# EAGLE design SparkFun RTK Facet - Cellular (EAGLE 9.6.2)
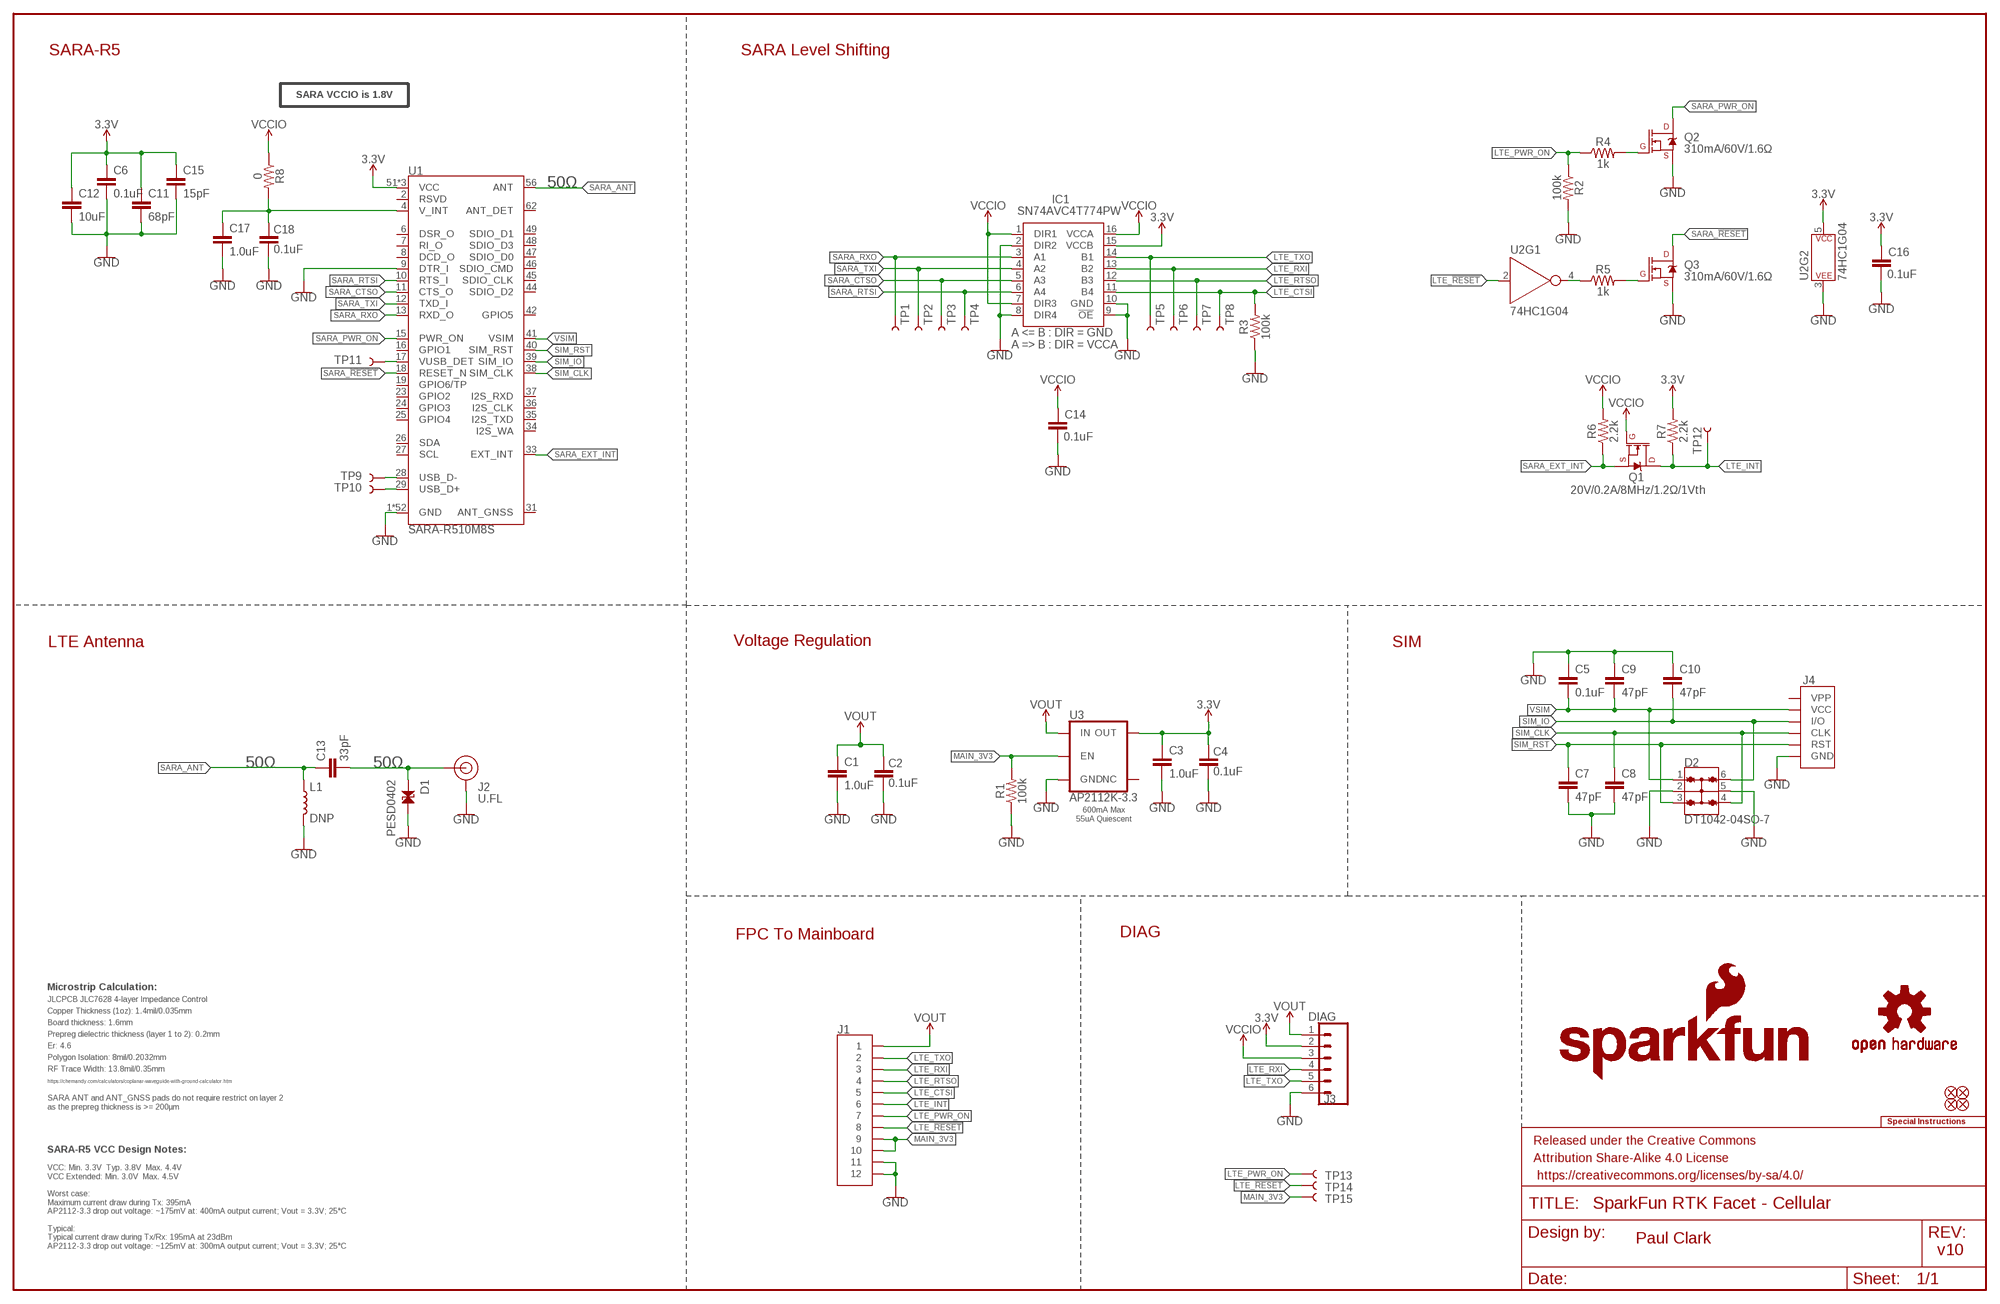
[diagram p0: schematic, sheet 1]

## Parts
C1  1.0uF  1.0UF-0603-16V-10%-X7R  [0603]
C2  0.1uF  0.1UF-0603-25V-5%  [0603]
C3  1.0uF  1.0UF-0603-16V-10%-X7R  [0603]
C4  0.1uF  0.1UF-0603-25V-5%  [0603]
C5  0.1uF  0.1UF-0603-25V-5%  [0603]
C6  0.1uF  0.1UF-0603-25V-5%  [0603]
C7  47pF  47PF-0603-50V-5%  [0603]
C8  47pF  47PF-0603-50V-5%  [0603]
C9  47pF  47PF-0603-50V-5%  [0603]
C10  47pF  47PF-0603-50V-5%  [0603]
C11  68pF  68PF-0603-50V-5%  [0603]
C12  10uF  10UF-0603-6.3V-20%  [0603]
C13  33pF  33PF-0402-25V-5%-X7R  [0402]
C14  0.1uF  0.1UF-0603-25V-(+80/-20%)  [0603]
C15  15pF  15PF-0603-50V-5%  [0603]
C16  0.1uF  0.1UF-0603-25V-(+80/-20%)  [0603]
C17  1.0uF  1.0UF-0603-16V-10%-X7R  [0603]
C18  0.1uF  0.1UF-0603-25V-5%  [0603]
D1  PESD0402  [0402]
D2  DT1042-04SO-7  TVS_DIODE_ARRAY_4DT1042-04SO-7  [SOT23-6L]
FID1  FIDUCIAL1X2  [FIDUCIAL-1X2]
FID2  FIDUCIAL1X2  [FIDUCIAL-1X2]
FID3  FIDUCIAL1X2  [FIDUCIAL-1X2]
FID4  FIDUCIAL1X2  [FIDUCIAL-1X2]
FRAME3  FRAME-LEDGER  [CREATIVE_COMMONS]
IC1  SN74AVC4T774PW  [SOP65P640X120-16N]
J1  FPC_12_0.5MM_BACKFLIP  [FPC_12_DOUBLESIDED_BACKFLIP]
J2  U.FL  U.FL2PIN  [U.FL]
J3  DIAG  CONN_06NO_SILK_FEMALE_PTH  [1X06_NO_SILK]
J4  SIMHOLDER-PUSHPUSH-REDUCED-PADS  [NANO_SIM_PP_REDUCED_PADS]
L1  DNP  INDUCTOR_DNP-0402  [0402_COILCRAFT]
LOGO1  SPECIAL_INSTRUCTIONS-ORDERING  [ORDERING_INSTRUCTIONS]
LOGO2  SFE_LOGO_NAME_FLAME.1_INCH  [SFE_LOGO_NAME_FLAME_.1]
LOGO3  OSHW-LOGOMINI  [OSHW-LOGO-MINI]
LOGO4  OSHW-LOGOMINI  [OSHW-LOGO-MINI]
LOGO5  SFE_LOGO_NAME_FLAME.1_INCH  [SFE_LOGO_NAME_FLAME_.1]
Q1  20V/0.2A/8MHz/1.2Ω/1Vth  MOSFET-NCH-RE1C002UNTCL  [SOT-416FL]
Q2  310mA/60V/1.6Ω  MOSFET-NCH-2N7002PW  [SOT323]
Q3  310mA/60V/1.6Ω  MOSFET-NCH-2N7002PW  [SOT323]
R1  100k  100KOHM-0603-1/10W-1%  [0603]
R2  100k  100KOHM-0603-1/10W-1%  [0603]
R3  100k  100KOHM-0603-1/10W-1%  [0603]
R4  1k  1KOHM-0603-1/10W-1%  [0603]
R5  1k  1KOHM-0603-1/10W-1%  [0603]
R6  2.2k  2.2KOHM-0603-1/10W-1%  [0603]
R7  2.2k  2.2KOHM-0603-1/10W-1%  [0603]
R8  0  0OHM-0603-1/10W  [0603]
TP1  TEST-POINT3  [PAD.03X.03]
TP2  TEST-POINT3  [PAD.03X.03]
TP3  TEST-POINT3  [PAD.03X.03]
TP4  TEST-POINT3  [PAD.03X.03]
TP5  TEST-POINT3  [PAD.03X.03]
TP6  TEST-POINT3  [PAD.03X.03]
TP7  TEST-POINT3  [PAD.03X.03]
TP8  TEST-POINT3  [PAD.03X.03]
TP9  TEST-POINT3  [PAD.03X.03]
TP10  TEST-POINT3  [PAD.03X.03]
TP11  TEST-POINT3  [PAD.03X.03]
TP12  TEST-POINT3  [PAD.03X.03]
TP13  TEST-POINT3  [PAD.03X.03]
TP14  TEST-POINT3  [PAD.03X.03]
TP15  TEST-POINT3  [PAD.03X.03]
U1  SARA-R510M8S  [SARA-LGA]
U2  74HC1G04  [SOT353]
U3  AP2112K-3.3  V_REG_AP2112K-3.3V  [SOT23-5]

## Nets
3.3V [power]: C3.1 C4.2 C6.1 C11.1 C12.1 C15.1 C16.1 IC1.15(VCCB) J3.2 R7.2 U1.51(VCC) U1.52(VCC) U1.53(VCC) U2.5(P$V+) U3.5(OUT)
GND: C1.2 C2.1 C3.2 C4.1 C5.1 C6.2 C7.2 C8.2 C9.1 C10.1 C11.2 C12.2 C14.2 C15.2 C16.2 C17.2 C18.1 D1.2 D2.2 D2.5 IC1.2(DIR2) IC1.8(DIR4) IC1.9(!OE) IC1.10(GND) J1.11 J1.12 J2.1(GND) J2.2(GND) J3.6 J4.C5(GND) L1.P$2 Q2.2(S) Q3.2(S) R1.1 R2.2 R3.1 U1.1(GND) U1.3(GND) U1.5(GND) U1.9(DTR_I) U1.14(GND) U1.20(GND) U1.21(GND) U1.22(GND) U1.30(GND) U1.32(GND) U1.43(GND) U1.50(GND) U1.54(GND) U1.55(GND) U1.57(GND) U1.58(GND) U1.59(GND) U1.60(GND) U1.61(GND) U1.63(GND) U1.64(GND) U1.65(GND) U1.66(GND) U1.67(GND) U1.68(GND) U1.69(GND) U1.70(GND) U1.71(GND) U1.72(GND) U1.73(GND) U1.74(GND) U1.75(GND) U1.76(GND) U1.77(GND) U1.78(GND) U1.79(GND) U1.80(GND) U1.81(GND) U1.82(GND) U1.83(GND) U1.84(GND) U1.85(GND) U1.86(GND) U1.87(GND) U1.88(GND) U1.89(GND) U1.90(GND) U1.91(GND) U1.92(GND) U1.93(GND) U1.94(GND) U1.95(GND) U1.96(GND) U2.3(P$V-) U3.2(GND)
LTE_!RESET!: J1.8 TP14.1 U2.2(A)
LTE_CTSI: IC1.11(B4) J1.5 R3.2 TP8.1
LTE_INT: J1.6 Q1.3(D) R7.1 TP12.1
LTE_PWR_ON: J1.7 R2.1 R4.1 TP13.1
LTE_RTSO: IC1.12(B3) J1.4 TP7.1
LTE_RXI: IC1.13(B2) J1.3 J3.4 TP6.1
LTE_TXO: IC1.14(B1) J1.2 J3.5 TP5.1
MAIN_3V3: J1.9 J1.10 R1.2 TP15.1 U3.3(EN)
N$1: TP9.1 U1.28(USB_D-)
N$2: TP10.1 U1.29(USB_D+)
N$3: TP11.1 U1.17(VUSB_DET)
N$15: C13.2 D1.1 J2.FEED(SIGNAL)
N$26: Q2.1(G) R4.2
N$27: Q3.1(G) R5.2
N$28: R5.1 U2.4(Y)
N$31: C17.1 C18.2 R8.2 U1.4(V_INT)
SARA_!RESET!: Q3.3(D) U1.18(RESET_N)
SARA_ANT: C13.1 L1.P$1 U1.56(ANT)
SARA_CTSO: IC1.5(A3) TP3.1 U1.11(CTS_O)
SARA_EXT_INT: Q1.2(S) R6.1 U1.33(EXT_INT)
SARA_PWR_ON: Q2.3(D) U1.15(PWR_ON)
SARA_RTSI: IC1.6(A4) TP4.1 U1.10(RTS_I)
SARA_RXO: IC1.3(A1) TP1.1 U1.13(RXD_O)
SARA_TXI: IC1.4(A2) TP2.1 U1.12(TXD_I)
SIM_CLK: C8.1 D2.4 J4.C3(CLK) U1.38(SIM_CLK)
SIM_IO: C10.2 D2.6 J4.C7(I/O) U1.39(SIM_IO)
SIM_RST: C7.1 D2.3 J4.C2(RST) U1.40(SIM_RST)
VCCIO: C14.1 IC1.1(DIR1) IC1.7(DIR3) IC1.16(VCCA) J3.3 Q1.1(G) R6.2 R8.1
VOUT: C1.1 C2.2 J1.1 J3.1 U3.1(IN)
VSIM: C5.2 C9.2 D2.1 J4.C1(VCC) U1.41(VSIM)
Unconnected: J4.C6(VPP) U1.2(RSVD) U1.6(DSR_O) U1.7(RI_O) U1.8(DCD_O) U1.16(GPIO1) U1.19(GPIO6/TP) U1.23(GPIO2) U1.24(GPIO3) U1.25(GPIO4) U1.26(SDA) U1.27(SCL) U1.31(ANT_GNSS) U1.34(I2S_WA) U1.35(I2S_TXD) U1.36(I2S_CLK) U1.37(I2S_RXD) U1.42(GPIO5) U1.44(SDIO_D2) U1.45(SDIO_CLK) U1.46(SDIO_CMD) U1.47(SDIO_D0) U1.48(SDIO_D3) U1.49(SDIO_D1) U1.62(ANT_DET) U3.4(NC)

## Notes on the sheet
- SARA-R5 | SARA Level Shifting
- SARA VCCIO is 1.8V
- 50Ω
- LTE Antenna | Voltage Regulation | SIM
- 50Ω | 50Ω
- 600mA Max
  55uA Quiescent
- FPC To Mainboard | DIAG
- Microstrip Calculation:
- JLCPCB JLC7628 4-layer Impedance Control
- Copper Thickness (1oz): 1.4mil/0.035mm
- Board thickness: 1.6mm
- Prepreg dielectric thickness (layer 1 to 2): 0.2mm
- Er: 4.6
- Polygon Isolation: 8mil/0.2032mm
- RF Trace Width: 13.8mil/0.35mm
- https://chemandy.com/calculators/coplanar-waveguide-with-ground-calculator.htm
- SARA ANT and ANT_GNSS pads do not require restrict on layer 2
  as the prepreg thickness is >= 200µm
- SARA-R5 VCC Design Notes:
- VCC: Min. 3.3V  Typ. 3.8V  Max. 4.4V
  VCC Extended: Min. 3.0V  Max. 4.5V
  
  Worst case:
  Maximum current draw during Tx: 395mA
  AP2112-3.3 drop out voltage: ~175mV at: 400mA output current; Vout = 3.3V; 25°C
  
  Typical:
  Typical current draw during Tx/Rx: 195mA at 23dBm
  AP2112-3.3 drop out voltage: ~125mV at: 300mA output current; Vout = 3.3V; 25°C
- Paul Clark
- v10

## Library data of the parts
C1 C3 C17 = SparkFun-Capacitors:1.0UF: 1µF ceramic capacitors A capacitor is a passive two-terminal electrical component used to store electrical energy temporarily in an electric field.; PROD_ID: CAP-13930
C2 C4-C6 C18 = SparkFun-Capacitors:0.1UF: 0.1µF ceramic capacitors A capacitor is a passive two-terminal electrical component used to store electrical energy temporarily in an electric field.; PROD_ID: CAP-08604
C7-C10 = SparkFun-Capacitors:47PF: 47pF ceramic capacitors A capacitor is a passive two-terminal electrical component used to store electrical energy temporarily in an electric field.; PROD_ID: CAP-08913
C11 = SparkFun-Capacitors:68PF: 68pF ceramic capacitors A capacitor is a passive two-terminal electrical component used to store electrical energy temporarily in an electric field.; PROD_ID: CAP-14092
C12 = SparkFun-Capacitors:10UF: 10.0µF ceramic capacitors A capacitor is a passive two-terminal electrical component used to store electrical energy temporarily in an electric field.; PROD_ID: CAP-11015
C13 = New_Parts:33PF: 33pF ceramic capacitors A capacitor is a passive two-terminal electrical component used to store electrical energy temporarily in an electric field.; DIGIKEY_PART: 490-5936-1-ND; MANUFACTURER: Murata; MANU_PART: GRM1555C1H330JA; PROD_ID: CAP-15358
C14 C16 = SparkFun-Capacitors:0.1UF: 0.1µF ceramic capacitors A capacitor is a passive two-terminal electrical component used to store electrical energy temporarily in an electric field.; PROD_ID: CAP-00810
C15 = SparkFun-Capacitors:15PF: 15pF ceramic capacitors A capacitor is a passive two-terminal electrical component used to store electrical energy temporarily in an electric field.; PROD_ID: CAP-07881
D1 = New_Parts:PESD0402: ESD protection diode PESD is used to protect a signal line from ESD.; DIGIKEY_PART: PESD0402-140CT-ND; MOUSE_PART: 650-PESD0402-140; PROD_ID: DIO-15359
D2 = ublox:TVS_DIODE_ARRAY_4; PROD_ID: DIO-14095
FID1-FID4 = SparkFun-Aesthetics:FIDUCIAL: Fiducial Alignment Points Point-of-reference for pick-and-place machines and other optical instruments.
FRAME3 = SparkFun-Aesthetics:FRAME-LEDGER: Schematic Frame - Ledger Standard 11x14 US Ledger frame
IC1 = New_Parts:SN74AVC4T774PW: Texas Instruments,SN74AVC4T774PW,IC, Texas Instruments SN74AVC4T774PW, Dual, Bus Transceiver, 4-Bit Non-Inverting 3-State, 1.2 3.6 V, 16-Pin TSSOP Source: Datasheet <http://www.ti.com/lit/ds/symlink/sn74avc4t774.pdf>; ARROW_PART_NUMBER: SN74AVC4T774PW; ARROW_PRICE-STOCK: https://www.arrow.com/en/products/sn74avc4t774pw/texas-instruments; DESCRIPTION: Texas Instruments,SN74AVC4T774PW,IC, Texas Instruments SN74AVC4T774PW, Dual, Bus Transceiver, 4-Bit Non-Inverting 3-State, 1.2 3.6 V, 16-Pin TSSOP; MANUFACTURER_NAME: Texas Instruments; MANUFACTURER_PART_NUMBER: SN74AVC4T774PW; MOUSER_PART_NUMBER: 595-SN74AVC4T774PW; MOUSER_PRICE-STOCK: https://www.mouser.co.uk/ProductDetail/Texas-Instruments/SN74AVC4T774PW?qs=WxL8HmPi5r44hV1AE7gRvg%3D%3D; PROD_ID: IC-15360
J1 = RTK Facet:FPC_12_0.5MM; PROD_ID: CONN-15766
J2 = SparkFun-Connectors:U.FL2PIN: SMD Antenna Connector - U.FL 2mm height, 3.0mm x 3.0mm receptacle size. SparkFun Products: SparkFun WiFi Shield - ESP8266 <https://www.sparkfun.com/products/13287> SparkFun ESP8266 Thing <https://www.sparkfun.com/products/13231> SparkFun MiniGen - Pro Mini Signal Generator Shield <https://www.sparkfun.com/products/11420>; PROD_ID: CONN-09193; SF_ID: WRL-09144
J3 = SparkFun-Connectors:CONN_06: Multi connection point. Often used as Generic Header-pin footprint for 0.1 inch spaced/style header connections On any of the 0.1 inch spaced packages, you can populate with these: Break Away Headers - Straight <https://www.sparkfun.com/products/116> (PRT-00116) Break Away Male Headers - Right Angle <https://www.sparkfun.com/products/553> (PRT-00553) Female Headers <https://www.sparkfun.com/products/115> (PRT-00115) Break Away Headers - Machine Pin <https://www.sparkfun.com/products/117> (PRT-00117) Break Away Female Headers - Swiss Machine Pin <https://www.sparkfun.com/products/743> (PRT-00743) Arduino Stackable Header - 6 Pin <https://www.sparkfun.com/products/9280> (PRT-09280) For SCREWTERMINALS and SPRING TERMINALS visit here: Screw Terimnals on SparkFun.com <https://www.sparkfun.com/search/results?term=Screw+Terminals> (5mm/3.5mm/2.54mm spacing) This device is also useful as a general connection point to wire up your design to another part of your project. Our various solder wires solder well into these plated through hole pads. Hook-Up Wire - Assortment (Stranded, 22 AWG) <https://www.sparkfun.com/products/11375> (PRT-11375) Hook-Up Wire - Assortment (Solid Core, 22 AWG) <https://www.sparkfun.com/products/11367> (PRT-11367) View the entire wire category on our website here <https://www.sparkfun.com/categories/141>; PROD_ID: CONN-08437
J4 = SparkFun-Connectors:SIMHOLDER: SIM Cellular Card Socket SMT 6 pin standard connection. SparkFun Products: SIM Socket <https://www.sparkfun.com/products/548> SparkFun Cellular Shield - MG2639 <https://www.sparkfun.com/products/13120> SparkFun SIM Card Socket Breakout <https://www.sparkfun.com/products/573>; PROD_ID: CONN-16272
L1 = New_Parts:INDUCTOR_DNP
LOGO1 = SparkFun-Aesthetics:SPECIAL_INSTRUCTIONS: Special Ordering/Production Instructions Alert Symbol for special PCB ordering instructions or unique production process warnings. Ordering Instructions Production Instructions Types of information that should be added to box: Copper weight Soldermask color Silk color PCB thickness Number of layers PCB Standard: 1.6mm FR4 1 oz copper immersion silver plating red soldermask white silkscreen Types of information that should be added to box: Special wash requirements Depaneling instructions Humidification Glue curing Default text settings: 0.07 inch 9% ratio 50% line distance
LOGO2 LOGO5 = SparkFun-Aesthetics:SFE_LOGO_NAME_FLAME: SparkFun Font Logo w/ Flame This is the SparkFun full logo. The logo on the schematic will always be the same size; the package variant is the height of the flame part of the logo. Default layer for the logo on the board is tSilk.
LOGO3 LOGO4 = SparkFun-Aesthetics:OSHW-LOGO: Open-Source Hardware (OSHW) Logo This logo indicates the piece of hardware it is found on incorporates a OSHW license and/or adheres to the definition of open source hardware found here: http://freedomdefined.org/OSHW
Q1 = SparkFun-DiscreteSemi:MOSFET-NCH: N-channel MOSFETs Voltage controlled devices that allow control of high current outputs. SparkFun Products: SparkFun OpenScale <https://www.sparkfun.com/products/13261> SparkFun Digital Sandbox <https://www.sparkfun.com/products/12651> SparkFun Monster Moto Shield <https://www.sparkfun.com/products/10182> SparkFun MOSFET Power Controller <https://www.sparkfun.com/products/11214>; PROD_ID: TRANS-14399
Q2 Q3 = SparkFun-DiscreteSemi:MOSFET-NCH: N-channel MOSFETs Voltage controlled devices that allow control of high current outputs. SparkFun Products: SparkFun OpenScale <https://www.sparkfun.com/products/13261> SparkFun Digital Sandbox <https://www.sparkfun.com/products/12651> SparkFun Monster Moto Shield <https://www.sparkfun.com/products/10182> SparkFun MOSFET Power Controller <https://www.sparkfun.com/products/11214>; PROD_ID: TRANS-11151
R1-R3 = SparkFun-Resistors:100KOHM: 100kΩ resistor A resistor is a passive two-terminal electrical component that implements electrical resistance as a circuit element. Resistors act to reduce current flow, and, at the same time, act to lower voltage levels within circuits. - Wikipedia; PROD_ID: RES-07828
R4 R5 = SparkFun-Resistors:1KOHM: 1kΩ resistor A resistor is a passive two-terminal electrical component that implements electrical resistance as a circuit element. Resistors act to reduce current flow, and, at the same time, act to lower voltage levels within circuits. - Wikipedia; PROD_ID: RES-07856
R6 R7 = SparkFun-Resistors:2.2KOHM: 2.2kΩ resistor A resistor is a passive two-terminal electrical component that implements electrical resistance as a circuit element. Resistors act to reduce current flow, and, at the same time, act to lower voltage levels within circuits. - Wikipedia; PROD_ID: RES-08272
R8 = SparkFun-Resistors:0OHM: 0Ω resistor A resistor is a passive two-terminal electrical component that implements electrical resistance as a circuit element. Resistors act to reduce current flow, and, at the same time, act to lower voltage levels within circuits. - Wikipedia; PROD_ID: RES-08609
TP1-TP15 = SparkFun-Connectors:TEST-POINT: SparkFun Test Points Bare copper test points for troubleshooting or In-Circuit-Testing. These are used by our Production team for verifying production board runs using pogo-pins on test beds. SparkFun Products: SparkFun LSM9DS1 Breakout <https://www.sparkfun.com/products/13284> SparkFun PSOC <https://www.sparkfun.com/products/13714> SparkFun Load Cell Amplifier <https://www.sparkfun.com/products/13879>
U1 = SARA_R5:SARA-R510M8S; PROD_ID: IC-15573
U2 = SparkFun-IC-Logic:74*1G04: Single Inverter IC NOT GATE INVERTER SNGL 1IN SOT353 Supply: 1.65V to 5.5V Datasheet <http://diodes.com/datasheets/74LVC1G04.pdf> SparkFun Products SparkFun Stepoko <https://www.sparkfun.com/products/13899> (ROB-13899) SparkFun CryptoShield <https://www.sparkfun.com/products/13183> (DEV-13183) SparkFun LogicBlocks Kit <https://www.sparkfun.com/products/11006> (KIT-11006) SparkFun ArduMoto <https://www.sparkfun.com/products/9815> (DEV-09815); PROD_ID: COMP-08268
U3 = SparkFun-IC-Power:V_REG_AP2112: AP2112 - 600mA CMOS LDO Regulator w/ Enable The AP2112 is CMOS process low dropout linear regulator with enable function, the regulator delivers a guaranteed 600mA (min.) continuous load current. Features Output Voltage Accuracy: ±1.5% Output Current: 600mA (Min.) Foldback Short Current Protection: 50mA Enable Function to Turn ON/OFF VOUT Low Dropout Voltage (3.3V): 250mV (Typ.) @IOUT=600mA Excellent Load Regulation: 0.2%/A (Typ.) Excellent Line Regulation: 0.02%/V (Typ.) Low Quiescent Current: 55μA (Typ.) Low Standby Current: 0.01μA (Typ.) Low Output Noise: 50μVRMS PSRR: 100Hz -65dB, 1kHz -65dB OTSD Protection Stable with 1.0μF Flexible Cap: Ceramic, Tantalum and Aluminum Electrolytic Operation Temperature Range: -40°C to 85°C ESD: MM 400V, HBM 4000V; PROD_ID: VREG-12457; VALUE: 3.3V

## Net classes
0 default: width 0 mm, drill 0 mm
1 power: width 0.178 mm

## Board
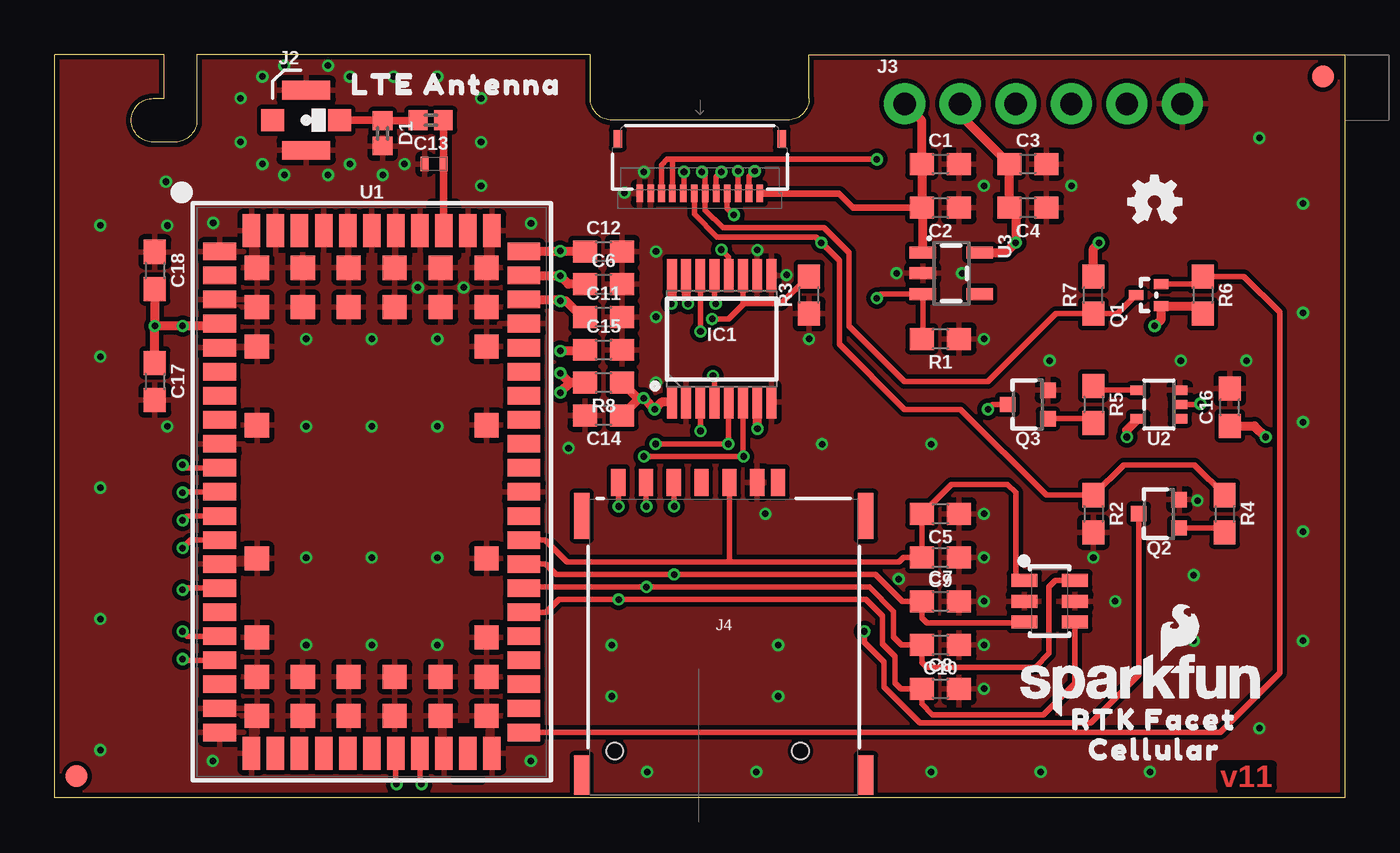
[diagram p1: board, top side]
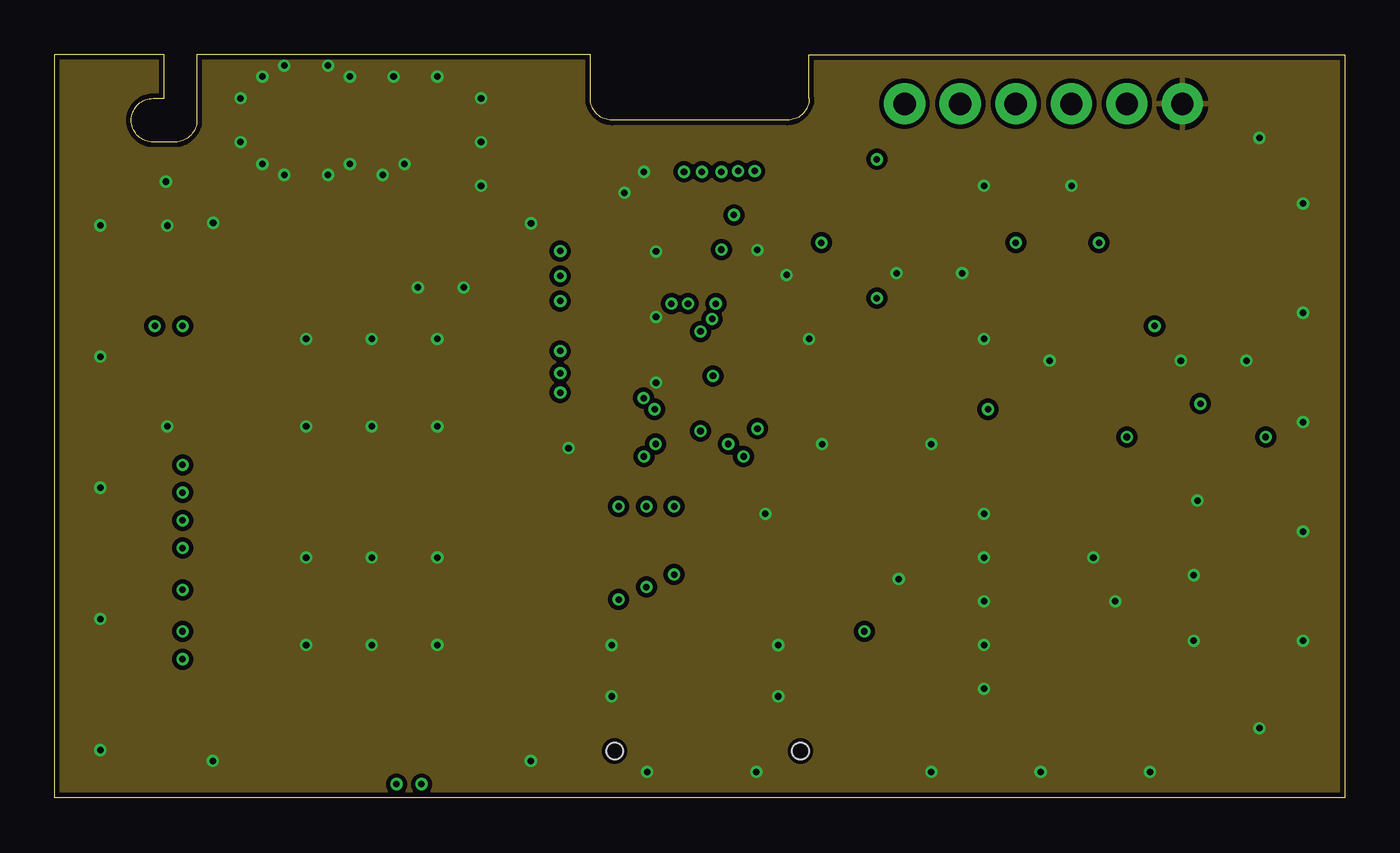
[diagram p2: board, inner layer Route2]
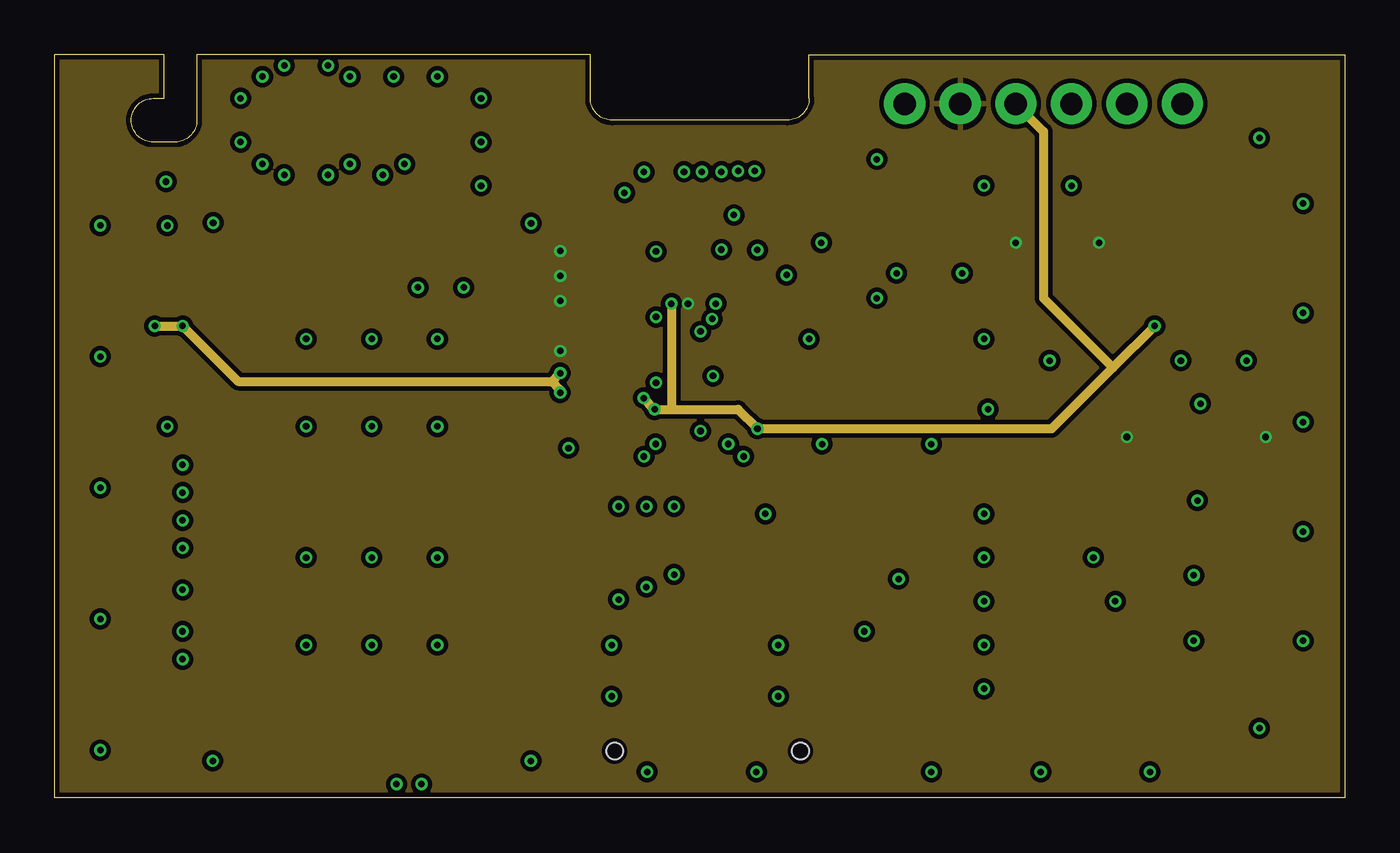
[diagram p3: board, inner layer Route15]
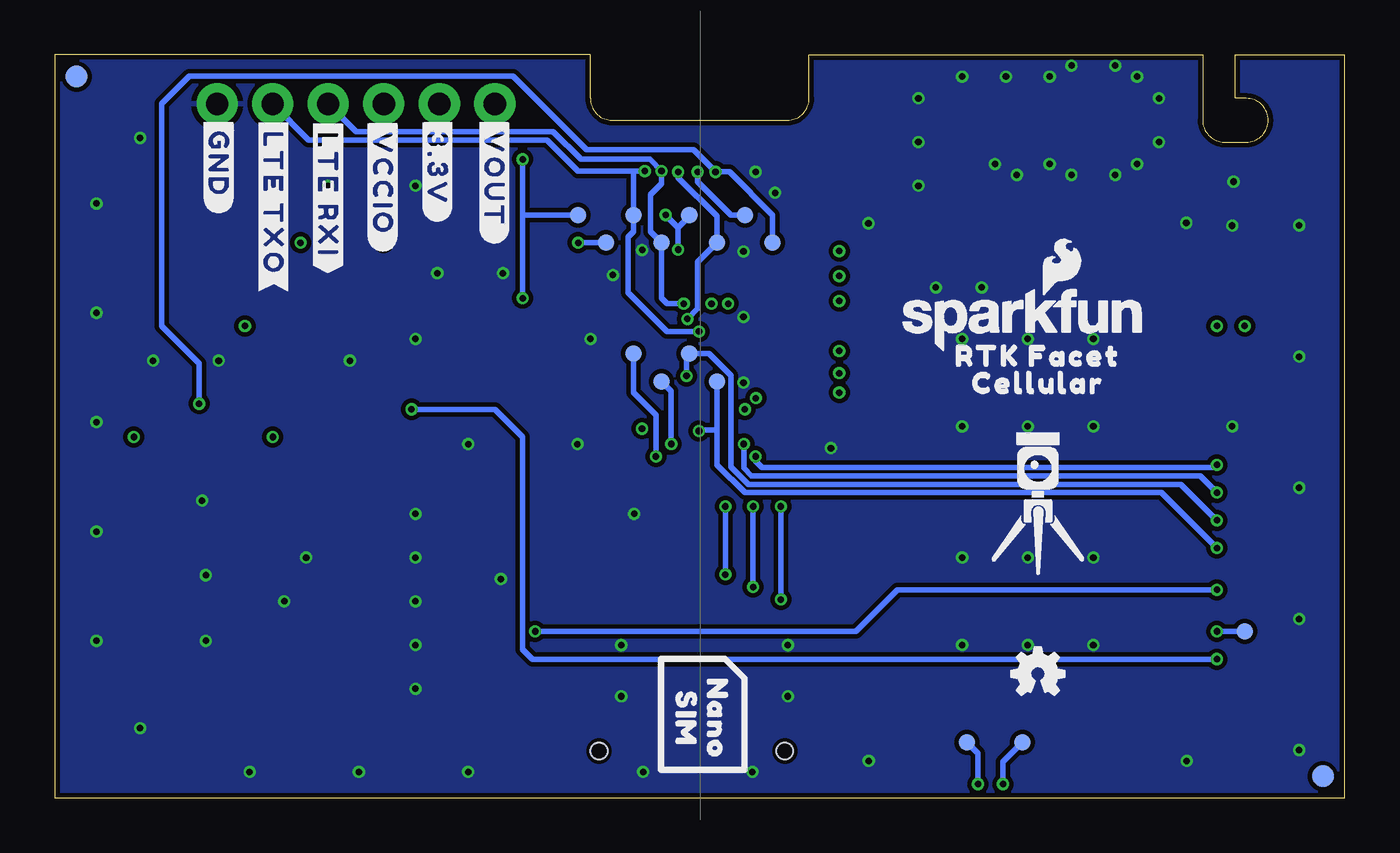
[diagram p4: board, bottom side, seen from below]

Size 59 x 34 mm. Coordinates in mm from the lower left corner, seen from the top.
Outline: 0,0 0,34 5,34 5,32 4.5,32 arc90 3.5,31 arc90 4.5,30 5.5,30 arc90 6.5,31 6.5,34 24.5,34 24.5,32 arc90 25.5,31 33.5,31 arc90 34.5,32 34.5,34 59,34 59,0 0,0
Copper layers (1*2*15*16): Top 0.035559375mm / dielectric 0.47751875mm / Route2 0.035559375mm / dielectric 0.47751875mm / Route15 0.035559375mm / dielectric 0.47751875mm / Bottom 0.035559375mm
Design rules "SparkFun-4-Layer-Minimum-JLCPCB": minimum track width 5mil, minimum drill 0.2mm, track to track 5mil, track to pad 5mil, pad to pad 5mil, via to via 5mil, smd to smd 5mil, copper to edge 7mil, drill to drill 7mil, minimum pad ring 5mil, minimum via ring 5mil, stop-mask expansion 2.5mil, vias tented up to drill 25mil, thermal gap 10mil
tKeepout: area 56,0 to 59,34; area 0,0 to 3,34
bKeepout: area 56,0 to 59,34; area 0,0 to 3,34
tRestrict: area 10.7,30.2 to 12.3,31.8; 2 lines

### Footprints (pad centres in the part's own frame; a part is rotated, then mirrored left to right if it is on the bottom)
0603 = smd 1.1 x 1: 1 -0.85,0; 2 0.85,0
0402 = smd 0.85 x 0.9: 1 -0.58,0; 2 0.58,0
SOT23-6L = smd 0.6 x 1.2: 1 -0.95,-1.15; 2 0,-1.15; 3 0.95,-1.15; 4 0.95,1.15; 5 0,1.15; 6 -0.95,1.15
FIDUCIAL-1X2 = smd 1 x 1: 1 0,0
SOP65P640X120-16N = smd 1.5 x 0.45: 1 -2.9,2.275; 2 -2.9,1.625; 3 -2.9,0.975; 4 -2.9,0.325; 5 -2.9,-0.325; 6 -2.9,-0.975; 7 -2.9,-1.625; 8 -2.9,-2.275; 9 2.9,-2.275; 10 2.9,-1.625; 11 2.9,-0.975; 12 2.9,-0.325; 13 2.9,0.325; 14 2.9,0.975; 15 2.9,1.625; 16 2.9,2.275
FPC_12_DOUBLESIDED_BACKFLIP = smd 0.3 x 0.8: 1 -2.75,1.35; 2 -2.25,1.35; 3 -1.75,1.35; 4 -1.25,1.35; 5 -0.75,1.35; 6 -0.25,1.35; 7 0.25,1.35; 8 0.75,1.35; 9 1.25,1.35; 10 1.75,1.35; 11 2.25,1.35; 12 2.75,1.35 | smd 0.4 x 0.8: MP1 -3.75,-1.15; MP2 3.75,-1.15
U.FL = smd 2.2 x 0.85: 1 0,1.375; 2 0,-1.375 | smd 1.05 x 1: FEED 1.525,0; NC -1.525,0
1X06_NO_SILK = drill 1.016 pad 1.88: 1 0,0; 2 2.54,0; 3 5.08,0; 4 7.62,0; 5 10.16,0; 6 12.7,0
NANO_SIM_PP_REDUCED_PADS = smd 0.7 x 2.1: A1 6.495,6; A2 -6.495,6 | smd 0.7 x 1.8: A3 -6.495,-5.85; A4 6.495,-5.85 | smd 0.65 x 1.23: C1 0.255,7.535; C2 -2.285,7.535; C3 -4.825,7.535; C5 1.525,7.535; C6 -1.015,7.535; C7 -3.555,7.535; CD 2.475,7.535 | hole 0.75: 3.505,-4.75; -4.995,-4.75
0402_COILCRAFT = smd 0.356 x 0.66: P$1 -0.432,0; P$2 0.432,0
SOT-416FL = smd 0.46 x 0.65: 1 -0.5,-1.1; 2 0.5,-1.1; 3 0,0.05
SOT323 = smd 0.7 x 0.7: 1 -0.65,-0.925; 2 0.65,-0.925; 3 0,0.925
PAD.03X.03 = smd 0.762 x 0.762: 1 0,0
SARA-LGA = smd 0.8 x 1.5: 1 -11,-6.95; 2 -9.9,-6.95; 3 -8.8,-6.95; 4 -7.7,-6.95; 5 -6.6,-6.95; 6 -5.5,-6.95; 7 -4.4,-6.95; 8 -3.3,-6.95; 9 -2.2,-6.95; 10 -1.1,-6.95; 11 0,-6.95; 12 1.1,-6.95; 13 2.2,-6.95; 14 3.3,-6.95; 15 4.4,-6.95; 16 5.5,-6.95; 17 6.6,-6.95; 18 7.7,-6.95; 19 8.8,-6.95; 20 9.9,-6.95; 21 11,-6.95; 33 11,6.95; 34 9.9,6.95; 35 8.8,6.95; 36 7.7,6.95; 37 6.6,6.95; 38 5.5,6.95; 39 4.4,6.95; 40 3.3,6.95; 41 2.2,6.95; 42 1.1,6.95; 43 0,6.95; 44 -1.1,6.95; 45 -2.2,6.95; 46 -3.3,6.95; 47 -4.4,6.95; 48 -5.5,6.95; 49 -6.6,6.95; 50 -7.7,6.95; 51 -8.8,6.95; 52 -9.9,6.95; 53 -11,6.95 | smd 1.5 x 0.8: 22 11.95,-5.5; 23 11.95,-4.4; 24 11.95,-3.3; 25 11.95,-2.2; 26 11.95,-1.1; 27 11.95,0; 28 11.95,1.1; 29 11.95,2.2; 30 11.95,3.3; 31 11.95,4.4; 32 11.95,5.5; 54 -11.95,5.5; 55 -11.95,4.4; 56 -11.95,3.3; 57 -11.95,2.2; 58 -11.95,1.1; 59 -11.95,0; 60 -11.95,-1.1; 61 -11.95,-2.2; 62 -11.95,-3.3; 63 -11.95,-4.4; 64 -11.95,-5.5 | smd 1.1 x 1.1: 65 -10.25,-5.25; 66 -10.25,-3.15; 67 -10.25,-1.05; 68 -10.25,1.05; 69 -10.25,3.15; 70 -10.25,5.25; 71 -8.45,-5.25; 72 -8.45,-3.15; 73 -8.45,-1.05; 74 -8.45,1.05; 75 -8.45,3.15; 76 -8.45,5.25; 77 -6.65,-5.25; 78 -6.65,5.25; 79 -3.05,-5.25; 80 -3.05,5.25; 81 3.05,-5.25; 82 3.05,5.25; 83 6.65,-5.25; 84 6.65,5.25; 85 8.45,-5.25; 86 8.45,-3.15; 87 8.45,-1.05; 88 8.45,1.05; 89 8.45,3.15; 90 8.45,5.25; 91 10.25,-5.25; 92 10.25,-3.15; 93 10.25,-1.05; 94 10.25,1.05; 95 10.25,3.15; 96 10.25,5.25
SOT353 = smd 0.42 x 0.7: 1 -0.65,-0.95; 2 0,-0.95; 3 0.65,-0.95; 4 0.65,0.95; 5 -0.65,0.95
SOT23-5 = smd 0.55 x 1.2: 1 -0.95,-1.3; 2 0,-1.3; 3 0.95,-1.3; 4 0.95,1.3; 5 -0.95,1.3

### Placement (x,y rotation side)
C1  40.5,29 0 top
C2  40.5,27 180 top
C3  44.5,29 0 top
C4  44.5,27 180 top
C5  40.5,13 180 top
C6  25.1,23.5 0 top
C7  40.5,9 0 top
C8  40.5,5 0 top
C9  40.5,11 180 top
C10  40.5,7 180 top
C11  25.1,22 0 top
C12  25.1,25 0 top
C13  17.2,31 180 top
C14  25.1,17.5 180 top
C15  25.1,20.5 0 top
C16  53.74,17.87 90 top
C17  4.58,19.05 270 top
C18  4.58,24.13 270 top
D1  15,30.4 270 top
D2  45.5,9 270 top
FID1  1,1 0 bottom
FID2  58,33 0 bottom
FID3  58,33 0 top
FID4  1,1 0 top
FRAME3  91.44,-8.89 0 top  (outside the outline)
IC1  30.5,21 90 top
J1  29.5,29 180 top
J2  11.5,31 0 top
J3  38.87,31.75 0 top
J4  30.6,6.9 0 top
L1  17.35,29 180 top
LOGO1  73.66,50.8 0 top  (outside the outline)
LOGO2  14.67,21.89 0 bottom
LOGO3  50.3,27.28 0 top
LOGO4  14.04,5.69 0 bottom
LOGO5  49.72,5.17 0 top
Q1  49.5,23 90 top
Q2  50.5,13 90 top
Q3  44.5,18 90 top
R1  40.5,21 180 top
R2  47.5,13 270 top
R3  34.5,23 90 top
R4  53.5,13 270 top
R5  47.5,18 270 top
R6  52.5,23 270 top
R7  47.5,23 90 top
R8  25.1,19 180 top
TP1  28.71,19.05 90 bottom
TP2  29.98,20.32 90 bottom
TP3  31.25,19.05 90 bottom
TP4  32.52,20.32 90 bottom
TP5  32.52,26.67 90 bottom
TP6  31.25,25.4 90 bottom
TP7  29.98,26.67 90 bottom
TP8  28.71,25.4 90 bottom
TP9  14.74,2.54 0 bottom
TP10  17.28,2.54 0 bottom
TP11  4.58,7.62 0 bottom
TP12  27.44,26.67 90 bottom
TP13  33.79,25.4 0 bottom
TP14  26.17,25.4 0 bottom
TP15  35.06,26.67 0 bottom
U1  14.5,14 270 top
U2  50.5,18 90 top
U3  41,24 270 top
U$1  [RTK_FACET0]  14.04,20.22 0 bottom
U$2  [CELLULAR1]  50.3,2.21 0 top
U$3  [CELLULAR1]  14.04,18.97 0 bottom
U$4  [#VOUT#0]  38.9,28.3 270 bottom
U$5  [#3#3V#0]  41.5,28.8 270 bottom
U$6  [#VCCIO#0]  44,28.1 270 bottom
U$7  [#LTE_RXI#0]  46.5,27.6 270 bottom
U$8  [#LTE_TXO#0]  49,27.2 270 bottom
U$9  [#GND#0]  51.5,29 270 bottom
U$10  [LTE_ANTENNA0]  18.36,32.64 0 top
U$14  [RTK_FACET0]  50.3,3.58 0 top
U$15  [RTK5#SVG0]  14.04,13.46 0 bottom
U$130  [NANO0]  28.7,3.62 270 bottom
U$131  [SIM0]  30.13,3.62 270 bottom

### Tracks (layer width: path | path; a pad name or v marks a point on that pad's centre or on a via)
3.3V  (via drill 0.3)
  Top 0.406: C16.1 54.87,17.02 v55.38,16.51 | U2.5 49.03,16.83 v49.03,16.51 | R7.2 47.5,25.14 v47.76,25.4 | U3.5 43.5,24.95 v43.95,25.4 43.95,26.7 C4.2 C3.1 41.41,31.24 J3.2 | C15.1 24.2,20.45 v23.12,20.45 | C6.1 23.5,23.5 v23.12,23.88 23.1,23.9 U1.52 | C11.1 24.11,22 23.38,22.73 v23.12,22.73 23.05,22.8 U1.51 | C12.1 23.14,25 v23.12,25.02 21.47,25.02 U1.53 | IC1.15 28.88,22.7 v28.96,22.61
  pour Route15 (isolate 0.203): 0,0 0,34 59,34 59,0
GND  (via drill 0.3)
  other vias: 15,28.5 16,29 13.5,29 12.5,28.5 10.5,28.5 9.5,29 8.5,30 8.5,32 9.5,33 10.5,33.5 12.5,33.5 13.5,33 15.5,33 17.5,33 19.5,32 19.5,30 19.5,28 27.5,25 27.5,22 27.5,19 23.5,16 32.5,13 42.5,13 42.5,11 42.5,9 42.5,7 42.5,5 48.5,9 41.5,24 38.5,24 42.5,28 46.5,28 42.5,21 47.5,11 52.26,13.6 51.5,20 45.5,20 54.5,20 11.5,21 14.5,21 17.5,21 17.5,17 14.5,17 11.5,17 11.5,11 14.5,11 17.5,11 17.5,7 14.5,7 11.5,7 34.5,21 5.15,17 5.15,26.18 26.05,27.68 26.94,28.64 32.14,25.06 33.47,23.92 25.47,6.99 25.47,4.65 33.09,6.99 33.09,4.65 52.09,10.19 52.09,7.19 27.09,1.19 32.09,1.19 55.09,30.19 57.09,27.19 57.09,22.19 57.09,17.19 57.09,12.19 57.09,7.19 55.09,3.19 40.09,1.19 45.09,1.19 50.09,1.19 5.09,28.19 2.09,26.19 2.09,20.19 2.09,14.19 2.09,8.19 2.09,2.19 7.23,1.7 35.09,16.19 40.09,16.19 38.6,10.02 21.79,26.29 7.25,26.31 21.77,1.7 16.61,23.35 18.71,23.35
  pour Top (isolate 0.203): 0,0 0,34 59,34 59,0
  pour Bottom (isolate 0.203): 0,0 0,34 59,34 59,0
  pour Route2 (isolate 0.203): 0,0 0,34 59,34 59,0
LTE_!RESET!  (via drill 0.3)
  Top 0.254: J1.8 28.78,27.68 v28.78,28.64 | v52.4,18.03 52.36,18 U2.2
  Bottom 0.254: v52.4,18.03 52.4,19.88 54.11,21.59 54.11,31.75 52.84,33.02 38.04,33.02 34.68,29.65 29.8,29.65 v28.78,28.64 28.14,28.64 26.17,26.67 TP14.1
LTE_CTSI  (via drill 0.3)
  Top 0.254: J1.5 30.25,28.4 v30.49,28.64 | IC1.11 31.48,22.61 | 31.48,22.61 31.48,22.58 30.8,21.91 v30.07,21.91 | R3.2 34.46,23.85 33.22,22.61 31.48,22.61
  Bottom 0.254: v30.49,28.64 30.49,28.38 28.71,26.61 TP8.1 29.6,24.51 29.6,22.38 v30.07,21.91
LTE_INT  (via drill 0.3)
  Top 0.254: Q1.3 48.6,22.15 R7.1 45.78,22.15 42.68,19.05 38.87,19.05 36.33,21.59 36.33,24.96 35.19,26.1 30.55,26.1 29.75,26.9 J1.6 29.75,28.49 v29.6,28.64
  Bottom 0.254: v29.6,28.64 29.6,28.19 28.07,26.67 TP12.1
LTE_PWR_ON  (via drill 0.3)
  Top 0.254: R4.1 52.11,15.24 48.89,15.24 R2.1 45.34,13.85 41.41,17.78 38.87,17.78 35.89,20.77 35.89,24.57 v35.06,25.4 34.81,25.65 30.3,25.65 29.25,26.7 J1.7
  Bottom 0.254: TP13.1 v35.06,25.4
LTE_RTSO  (via drill 0.3)
  Top 0.254: IC1.12 30.82,24.75 v30.49,25.08 | J1.4 30.75,26.98 v31.06,26.67
  Bottom 0.254: v31.06,26.67 30.49,26.1 | 30.49,26.1 v30.49,25.08 | TP7.1 29.98,26.61 30.49,26.1
LTE_RXI  (via drill 0.3)
  Top 0.254: v31.25,28.68 J1.3 | v30.23,22.61 30.18,22.66 IC1.13
  Bottom 0.254: J3.4 45.22,30.48 36.2,30.48 34.93,29.21 31.78,29.21 v31.25,28.68 31.25,28.11 31.76,27.6 31.76,25.91 TP6.1 31.25,22.86 31,22.61 v30.23,22.61
LTE_TXO  (via drill 0.3)
  Top 0.254: v32.01,28.68 31.75,28.42 J1.2 | v29.54,21.34 29.54,23.89 IC1.14
  Bottom 0.254: J3.5 47.38,30.1 36.49,30.1 35.07,28.68 32.52,28.68 | 32.52,28.68 v32.01,28.68 | 32.52,28.68 TP5.1 32.52,25.91 32.77,25.65 32.77,23.11 31,21.34 v29.54,21.34
MAIN_3V3  (via drill 0.3)
  Top 0.254: J1.10 27.75,28.95 28.01,29.21 28.2,29.21 | 28.2,29.21 v37.6,29.21 | v37.6,22.86 37.79,23.05 U3.3 39.7,21.05 R1.2 | J1.9 28.25,29.16 28.2,29.21
  Bottom 0.254: v37.6,29.21 37.6,26.67 | 37.6,26.67 v37.6,22.86 | TP15.1 37.6,26.67
N$1  (via drill 0.3)
  Top 0.254: U1.28 15.6,0.66 v15.63,0.64
  Bottom 0.254: v15.63,0.64 15.63,1.65 TP9.1
N$2  (via drill 0.3)
  Top 0.254: U1.29 16.7,0.71 v16.77,0.64
  Bottom 0.254: v16.77,0.64 16.77,2.03 TP10.1
N$3  (via drill 0.3)
  Top 0.254: U1.17 6.07,7.4 v5.85,7.62
  Bottom 0.254: v5.85,7.62 TP11.1
N$15
  Top 0.35: J2.FEED 14.98,31 D1.1 16.6,30.98 C13.2
N$26
  Top 0.254: Q2.1 53.3,12.35 R4.2
N$27
  Top 0.254: Q3.1 47.3,17.35 R5.2
N$28
  Top 0.254: U2.4 47.7,18.65 R5.1
N$31  (via drill 0.3)
  Top 0.406: U1.4 7.44,21.59 v5.85,21.59 v4.58,21.59 | v23.12,19.43 23.55,19 R8.2 23.58,19 v23.12,18.54 | C17.1 v4.58,21.59 | C18.2 v4.58,21.59
  Route15 0.406: 22.74,19.05 v23.12,19.43 | 22.74,19.05 8.39,19.05 v5.85,21.59 v4.58,21.59 | v23.12,18.54 23.12,18.67 22.74,19.05
SARA_!RESET!  (via drill 0.3)
  Top 0.254: U1.18 5.9,6.3 v5.85,6.35 | v42.68,17.78 42.9,18 Q3.3
  Bottom 0.254: v5.85,6.35 37.16,6.35 37.6,6.79 37.6,16.51 38.87,17.78 v42.68,17.78
SARA_ANT
  Top 0.35: C13.1 L1.P$1 17.78,25.97 U1.56
SARA_CTSO  (via drill 0.3)
  Top 0.254: U1.11 5.88,14 v5.85,13.97 | v27.48,16.19 v30.8,16.19 30.8,18.08 IC1.5
  Bottom 0.254: v5.85,13.97 6.61,14.73 27.12,14.73 27.48,15.09 v27.48,16.19 | v30.8,16.19 30.8,18.61 TP3.1
SARA_EXT_INT
  Top 0.254: U1.33 53.3,3 56.02,5.71 56.02,22.23 54.39,23.85 R6.1 52.15,23.5 Q1.2
SARA_PWR_ON  (via drill 0.3)
  Top 0.254: U1.15 5.92,9.6 v5.85,9.53 | Q2.3 49.58,5.62 47.38,3.43 39.57,3.43 37.92,5.08 37.92,6.22 37.03,7.11 v37.03,7.62
  Bottom 0.254: v5.85,9.53 20.45,9.53 22.36,7.62 v37.03,7.62
SARA_RTSI  (via drill 0.3)
  Top 0.254: U1.10 5.99,15.1 v5.85,15.24 | v26.95,15.62 v31.5,15.62 31.48,15.65 IC1.6
  Bottom 0.254: v5.85,15.24 5.98,15.11 26.65,15.11 26.95,15.41 v26.95,15.62 | v31.5,15.62 31.5,17.53 32.52,18.54 TP4.1
SARA_RXO  (via drill 0.3)
  Top 0.254: U1.13 6.22,11.8 v5.85,11.43 | IC1.3 29.52,16.8 v29.54,16.79
  Bottom 0.254: v5.85,11.43 8.39,13.97 27.44,13.97 28.71,15.24 28.71,16.83 | v29.54,16.79 29.5,16.83 28.71,16.83 | TP1.1 28.71,16.83
SARA_TXI  (via drill 0.3)
  Top 0.254: U1.12 6.05,12.9 v5.85,12.7 | IC1.4 30.18,19.24 v30.11,19.3
  Bottom 0.254: v5.85,12.7 7.5,14.35 27.28,14.35 28.07,15.14 28.07,19.31 29.08,20.32 TP2.1 30.11,20.19 v30.11,19.3
SIM_CLK  (via drill 0.3)
  Top 0.254: U1.38 22.48,8.5 23.06,9.08 v25.79,9.08 37.09,9.08 37.85,8.32 37.85,7.05 38.42,6.48 38.42,5.27 38.7,5 C8.1 39.65,4.3 40.14,3.81 45.22,3.81 46.65,5.24 D2.4 | v25.79,13.34 25.79,14.42 J4.C3
  Bottom 0.254: v25.79,9.08 v25.79,13.34
SIM_IO  (via drill 0.3)
  Top 0.254: U1.39 21.51,9.66 27.05,9.66 v27.06,9.65 37.25,9.65 38.36,8.54 38.36,7.37 38.73,7 C10.2 39.65,6.21 39.89,5.97 44.84,5.97 45.47,6.6 45.47,9.65 45.77,9.95 D2.6 | v27.06,13.34 27.05,13.35 J4.C7
  Bottom 0.254: v27.06,9.65 v27.06,13.34
SIM_RST  (via drill 0.3)
  Top 0.254: U1.40 22.45,10.7 22.93,10.22 v28.33,10.22 37.54,10.22 38.76,9 C7.1 39.65,8.24 39.89,8 44.3,8 D2.3 | v28.33,13.34 28.33,14.42 J4.C2
  Bottom 0.254: v28.33,10.22 v28.33,13.34
VCCIO  (via drill 0.3)
  Top 0.406: C14.1 26.74,18.29 v26.93,18.29 | R8.1 26.66,18.29 v26.93,18.29 | v26.93,18.29 v27.44,17.78 27.76,18.1 IC1.1 | v32.14,16.89 32.14,18.09 IC1.7 | IC1.16 28.23,22.63 v28.2,22.61 | v50.3,21.59 50.6,21.89 Q1.1 52.15,22.5 R6.2
  Route15 0.406: 28.2,17.78 v27.44,17.78 v26.93,18.29 | 28.2,17.78 31.25,17.78 v32.14,16.89 45.6,16.89 48.4,19.68 | v28.2,22.61 28.2,17.78 | 48.4,19.68 v50.3,21.59 | J3.3 45.22,30.48 45.22,22.86 48.4,19.68
VOUT
  Top 0.305: J1.1 35.86,27.65 36.51,27 C2.2
  Top 0.406: U3.1 39.7,26.95 C2.2 C1.1 39.65,30.97 J3.1
VSIM
  Top 0.254: U1.41 22.43,11.8 23.44,10.79 30.87,10.79 | 30.87,10.79 38.62,10.79 38.83,11 C9.2 C5.2 41,14.35 43.57,14.35 43.95,13.97 43.95,9.95 D2.1 | J4.C1 30.86,10.81 30.87,10.79

### Text on the board
Top: v11
Measures: Dimensions in mm
tDocu: JLCPCB JLC7628 Impedance Control / 4-Layer PCB / 1.6mm Thickness / 1oz Copper (Outer Layers) / HASL RoHS Finish | FPC stiffener is 3mm | Paul Clark